# Altium schematic sheet ControlSignal.SchDoc
size A4
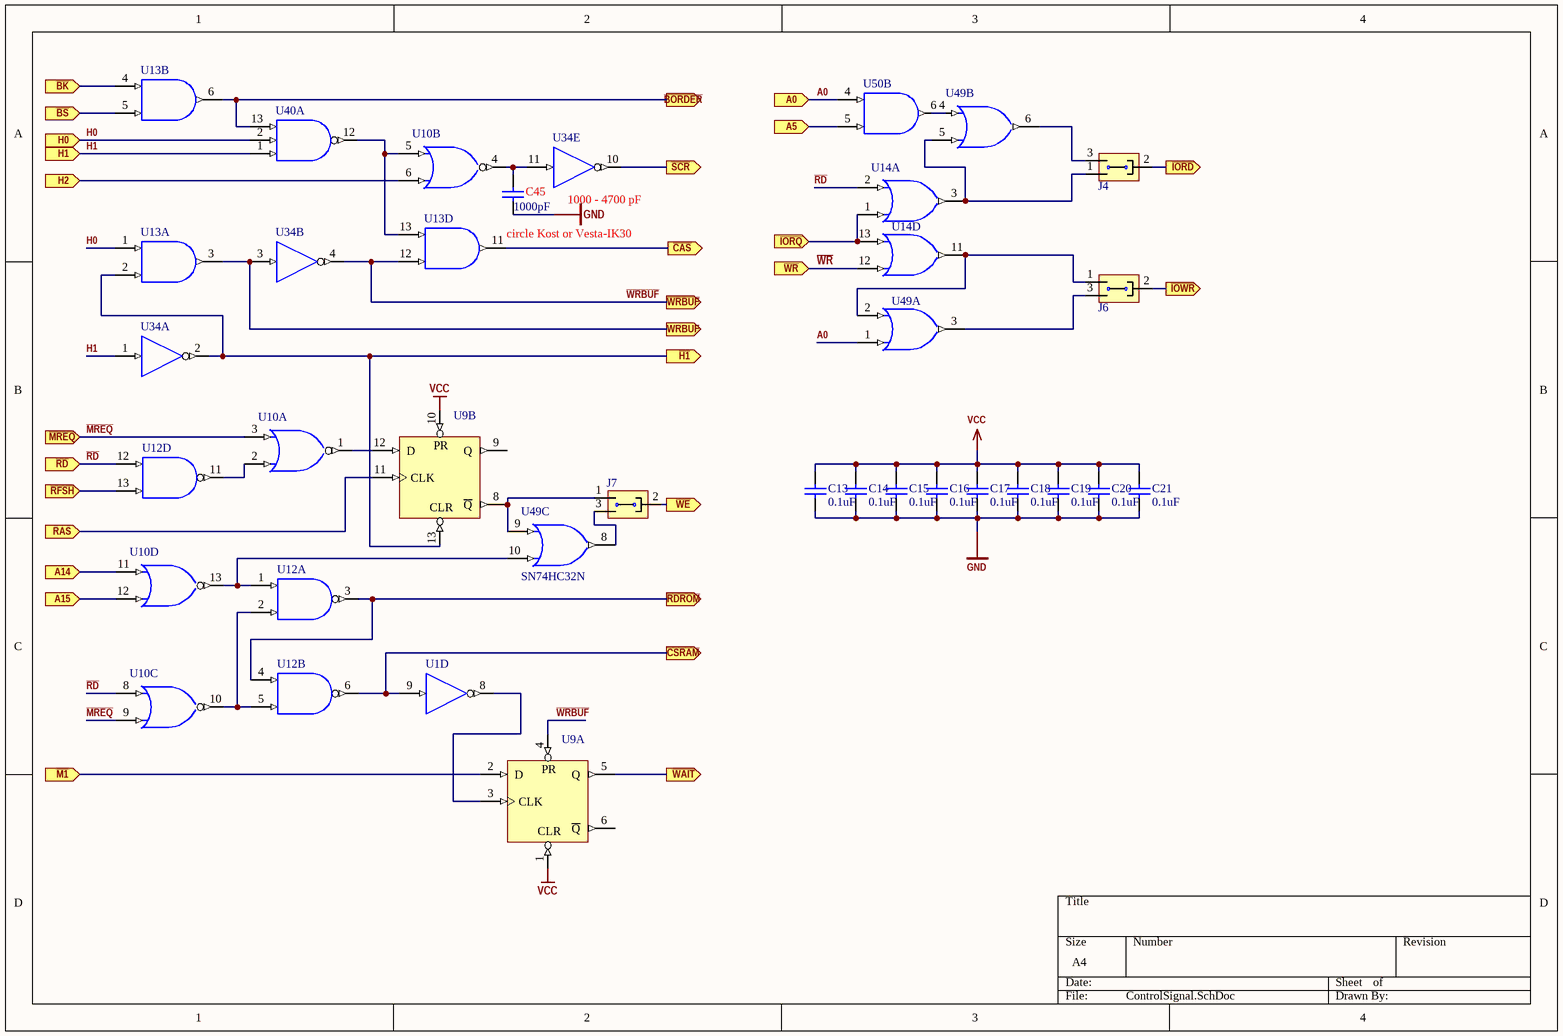
[diagram p0: ControlSignal.SchDoc]

## Parts
C13  value 0.1uF  [RAD-0.3]  (hidden comment: Cap)
C14  value 0.1uF  [RAD-0.3]  (hidden comment: Cap)
C15  value 0.1uF  [RAD-0.3]  (hidden comment: Cap)
C16  value 0.1uF  [RAD-0.3]  (hidden comment: Cap)
C17  value 0.1uF  [RAD-0.3]  (hidden comment: Cap)
C18  value 0.1uF  [RAD-0.3]  (hidden comment: Cap)
C19  value 0.1uF  [RAD-0.3]  (hidden comment: Cap)
C20  value 0.1uF  [RAD-0.3]  (hidden comment: Cap)
C21  value 0.1uF  [RAD-0.3]  (hidden comment: Cap)
C45  circle Kost or Vesta-IK30  value 1000pF  [RAD-0.3]
J4  Jump3  [MHDR1X3]  (value not drawn)
J6  Jump3  [MHDR1X3]  (value not drawn)
J7  Jump3  [MHDR1X3]  (value not drawn)
U1  (no value)  [N014]  (part D of 6)
U9  (no value)  [N014]  (parts A,B of 2)
U10  (no value)  [N014]  (parts A,B,C,D of 4)
U12  (no value)  [N014]  (parts A,B,D of 4)
U13  (no value)  [N014]  (parts A,B,D of 4)
U14  (no value)  [N014]  (parts A,D of 4)
U34  (no value)  [N014]  (parts A,B,E of 6)
U40  (no value)  [N014]  (part A of 3)
U49  SN74HC32N  [N014]  (value not drawn)  (parts A,B,C of 4)
U50  SN74HC08N  [N014]  (value not drawn)  (part B of 4)

## Ports
A0 (in), A5 (in), A14 (in), A15 (in), H0 (in), H1 (in), H2 (in), RAS (in), WRBUF (out), ~{BK} (in), ~{BORDER} (out), ~{BS} (in), ~{CAS} (out), ~{CSRAM} (out), ~{H1} (out), ~{IORD} (out), ~{IORQ} (in), ~{IOWR} (out), ~{M1} (in), ~{MREQ} (in), ~{RDROM} (out), ~{RD} (in), ~{RFSH} (in), ~{SCR} (out), ~{WAIT} (out), ~{WE} (out), ~{WRBUF} (out), ~{WR} (in)

## Nets
GND: C13.1 C14.1 C15.1 C16.1 C17.1 C18.1 C19.1 C20.1 C21.1 C45.1 U1.7(GND) U9.7(GND) U10.7(GND) U12.7(GND) U13.7(GND) U14.7(GND) U34.7(GND) U40.7(GND) U49.7(GND) U50.7(GND)
VCC: C13.2 C14.2 C15.2 C16.2 C17.2 C18.2 C19.2 C20.2 C21.2 U1.14(VCC) U9.1(CLR) U9.10(PR) U9.14(VCC) U10.14(VCC) U12.14(VCC) U13.14(VCC) U14.14(VCC) U34.14(VCC) U40.14(VCC) U49.14(VCC) U50.14(VCC)
A0: U49.1(A) U50.4(A) ; port A0
A5: U50.5(B) ; port A5
A14: U10.11(A) ; port A14
A15: U10.12(B) ; port A15
~{BK}: U13.4(A) ; port ~{BK}
~{BORDER}: U13.6(Y) U40.13(C) ; port ~{BORDER}
~{BS}: U13.5(B) ; port ~{BS}
~{CAS}: U13.11(Y) ; port ~{CAS}
~{CSRAM}: U1.9(A) U12.6(Y) ; port ~{CSRAM}
H0: U13.1(A) U40.2(B) ; port H0
H1: U34.1(A) U40.1(A) ; port H1
H2: U10.6(B) ; port H2
~{H1}: U9.13(CLR) U13.2(B) U34.2(Y) ; port ~{H1}
~{IORD}: J4.2 ; port ~{IORD}
~{IORQ}: U14.1(A) U14.13(B) ; port ~{IORQ}
~{IOWR}: J6.2 ; port ~{IOWR}
~{M1}: U9.2(D) ; port ~{M1}
~{MREQ}: U10.3(B) U10.9(B) ; port ~{MREQ}
~{RD}: U10.8(A) U12.12(A) U14.2(B) ; port ~{RD}
~{RDROM}: U12.3(Y) U12.4(A) ; port ~{RDROM}
~{RFSH}: U12.13(B) ; port ~{RFSH}
RAS: U9.11(CLK) ; port RAS
~{SCR}: U34.10(Y) ; port ~{SCR}
~{WAIT}: U9.5(Q) ; port ~{WAIT}
~{WE}: J7.2 ; port ~{WE}
~{WR}: U14.12(A) ; port ~{WR}
~{WRBUF}: U9.4(PR) U13.12(A) U34.4(Y) ; port ~{WRBUF}
WRBUF: U13.3(Y) U34.3(A) ; port WRBUF
NetC45_2: C45.2 U10.4(Y) U34.11(A)
NetJ4_1: J4.1 U14.3(Y) U49.5(B)
NetJ4_3: J4.3 U49.6(Y)
NetJ6_1: J6.1 U14.11(Y) U49.2(B)
NetJ6_3: J6.3 U49.3(Y)
NetJ7_1: J7.1 U9.8(~{Q}) U49.9(A)
NetJ7_3: J7.3 U49.8(Y)
NetU1_8: U1.8(Y) U9.3(CLK)
NetU9_12: U9.12(D) U10.1(Y)
NetU10_2: U10.2(A) U12.11(Y)
NetU10_5: U10.5(A) U13.13(B) U40.12(Y)
NetU10_10: U10.10(Y) U12.2(B) U12.5(B)
NetU10_13: U10.13(Y) U12.1(A) U49.10(B)
NetU49_4: U49.4(A) U50.6(Y)

Not connected (* = marked no-connect by the designer): U9 6(~{Q}) 9(Q)

## Notes on the sheet
- (near U34) 1000 - 4700 pF

## Library data of the parts
C13-C21 C45 = Cap: Capacitor; Published: 8-Jun-2000; LatestRevisionDate: 17-Jul-2002; LatestRevisionNote: Re-released for DXP Platform.; PackageReference: RAD-0.3; Publisher: Altium Limited; PackageDescription: Radial Cap, Thru-Hole; 2 Leads; 0.3 in Pin Spacing
U1 U34 = SN74HC04N: Hex Inverter; Published: 8-Jun-2000; LatestRevisionDate: 04-Mar-2005; LatestRevisionNote: Stylized 3D Model Added.; DatasheetVersion: May-1997; PackageVersion: Oct-1995; PackageReference: N014; Publisher: Altium Limited; PackageDescription: DIP; 14 Leads; Row Spacing 7.62 mm; Pitch 2.54 mm; ComponentLink1Description: Manufacturer Link; ComponentLink1URL: http://www.ti.com/; ComponentLink2Description: Datasheet; ComponentLink2URL: http://www-s.ti.com/sc/ds/sn74hc04.pdf
U9 = SN74HC74N: Dual D-Type Positive-Edge-Triggered Flip-Flop with Clear and Preset; Published: 8-Jun-2000; LatestRevisionDate: 04-Mar-2005; LatestRevisionNote: Stylized 3D Model Added.; DatasheetVersion: May-1997; PackageVersion: Oct-1995; PackageReference: N014; Publisher: Altium Limited; PackageDescription: DIP; 14 Leads; Row Spacing 7.62 mm; Pitch 2.54 mm; ComponentLink1Description: Manufacturer Link; ComponentLink1URL: http://www.ti.com/; ComponentLink2Description: Datasheet; ComponentLink2URL: http://www-s.ti.com/sc/ds/sn74hc74.pdf
U10 = SN74HC02N: Quadruple 2-Input Positive-NOR Gate; Published: 8-Jun-2000; LatestRevisionDate: 04-Mar-2005; LatestRevisionNote: Stylized 3D Model Added.; DatasheetVersion: May-1997; PackageVersion: Oct-1995; PackageReference: N014; Publisher: Altium Limited; PackageDescription: DIP; 14 Leads; Row Spacing 7.62 mm; Pitch 2.54 mm; ComponentLink1Description: Manufacturer Link; ComponentLink1URL: http://www.ti.com/; ComponentLink2Description: Datasheet; ComponentLink2URL: http://www-s.ti.com/sc/ds/sn74hc02.pdf
U12 = SN74HC00N: Quadruple 2-Input Positive-NAND Gate; Published: 8-Jun-2000; LatestRevisionDate: 04-Mar-2005; LatestRevisionNote: Stylized 3D Model Added.; DatasheetVersion: May-1997; PackageVersion: Oct-1995; PackageReference: N014; Publisher: Altium Limited; PackageDescription: DIP; 14 Leads; Row Spacing 7.62 mm; Pitch 2.54 mm; ComponentLink1Description: Manufacturer Link; ComponentLink1URL: http://www.ti.com/; ComponentLink2Description: Datasheet; ComponentLink2URL: http://www-s.ti.com/sc/ds/sn74hc00.pdf
U13 U50 = SN74HC08N: Quadruple 2-Input Positive-AND Gate; Published: 8-Jun-2000; LatestRevisionDate: 04-Mar-2005; LatestRevisionNote: Stylized 3D Model Added.; DatasheetVersion: May-1997; PackageVersion: Oct-1995; PackageReference: N014; Publisher: Altium Limited; PackageDescription: DIP; 14 Leads; Row Spacing 7.62 mm; Pitch 2.54 mm; ComponentLink1Description: Manufacturer Link; ComponentLink1URL: http://www.ti.com/; ComponentLink2Description: Datasheet; ComponentLink2URL: http://www-s.ti.com/sc/ds/SN74HC08.pdf
U14 U49 = SN74HC32N: Quadruple 2-Input Positive-OR Gate; Published: 8-Jun-2000; LatestRevisionDate: 04-Mar-2005; LatestRevisionNote: Stylized 3D Model Added.; DatasheetVersion: May-1997; PackageVersion: Oct-1995; PackageReference: N014; Publisher: Altium Limited; PackageDescription: DIP; 14 Leads; Row Spacing 7.62 mm; Pitch 2.54 mm; ComponentLink1Description: Manufacturer Link; ComponentLink1URL: http://www.ti.com/; ComponentLink2Description: Datasheet; ComponentLink2URL: http://www-s.ti.com/sc/ds/sn74hc32.pdf
U40 = SN74HC10N: Triple 3-Input Positive-NAND Gate; Published: 8-Jun-2000; LatestRevisionDate: 04-Mar-2005; LatestRevisionNote: Stylized 3D Model Added.; DatasheetVersion: May-1997; PackageVersion: Oct-1995; PackageReference: N014; Publisher: Altium Limited; PackageDescription: DIP; 14 Leads; Row Spacing 7.62 mm; Pitch 2.54 mm; ComponentLink1Description: Manufacturer Link; ComponentLink1URL: http://www.ti.com/; ComponentLink2Description: Datasheet; ComponentLink2URL: http://www-s.ti.com/sc/ds/sn74hc10.pdf